# Altium schematic sheet usb.SchDoc: {Наименование}
size 209 x 297 mm; DocumentNumber: {Обозначение}; SheetNumber: {}; SheetTotal: {}; PageSetup: Record=PageOptions|CenterHorizontal=False|CenterVertical=False|PrintScale=0.95|XCorrection=0.00|YCorrection=0.00|PrintKind=1|BorderSize=5000000|LeftOffset=0|BottomOffset=0|Orientation=1|PaperLength=1000|PaperWidth=1000|Scale=100|PaperSource=15|PrintQuality=600|MediaType=1|DitherType=10|PaperKind=A4|PrintScaleMode=1; Rule: PcbType=ProtelPcb
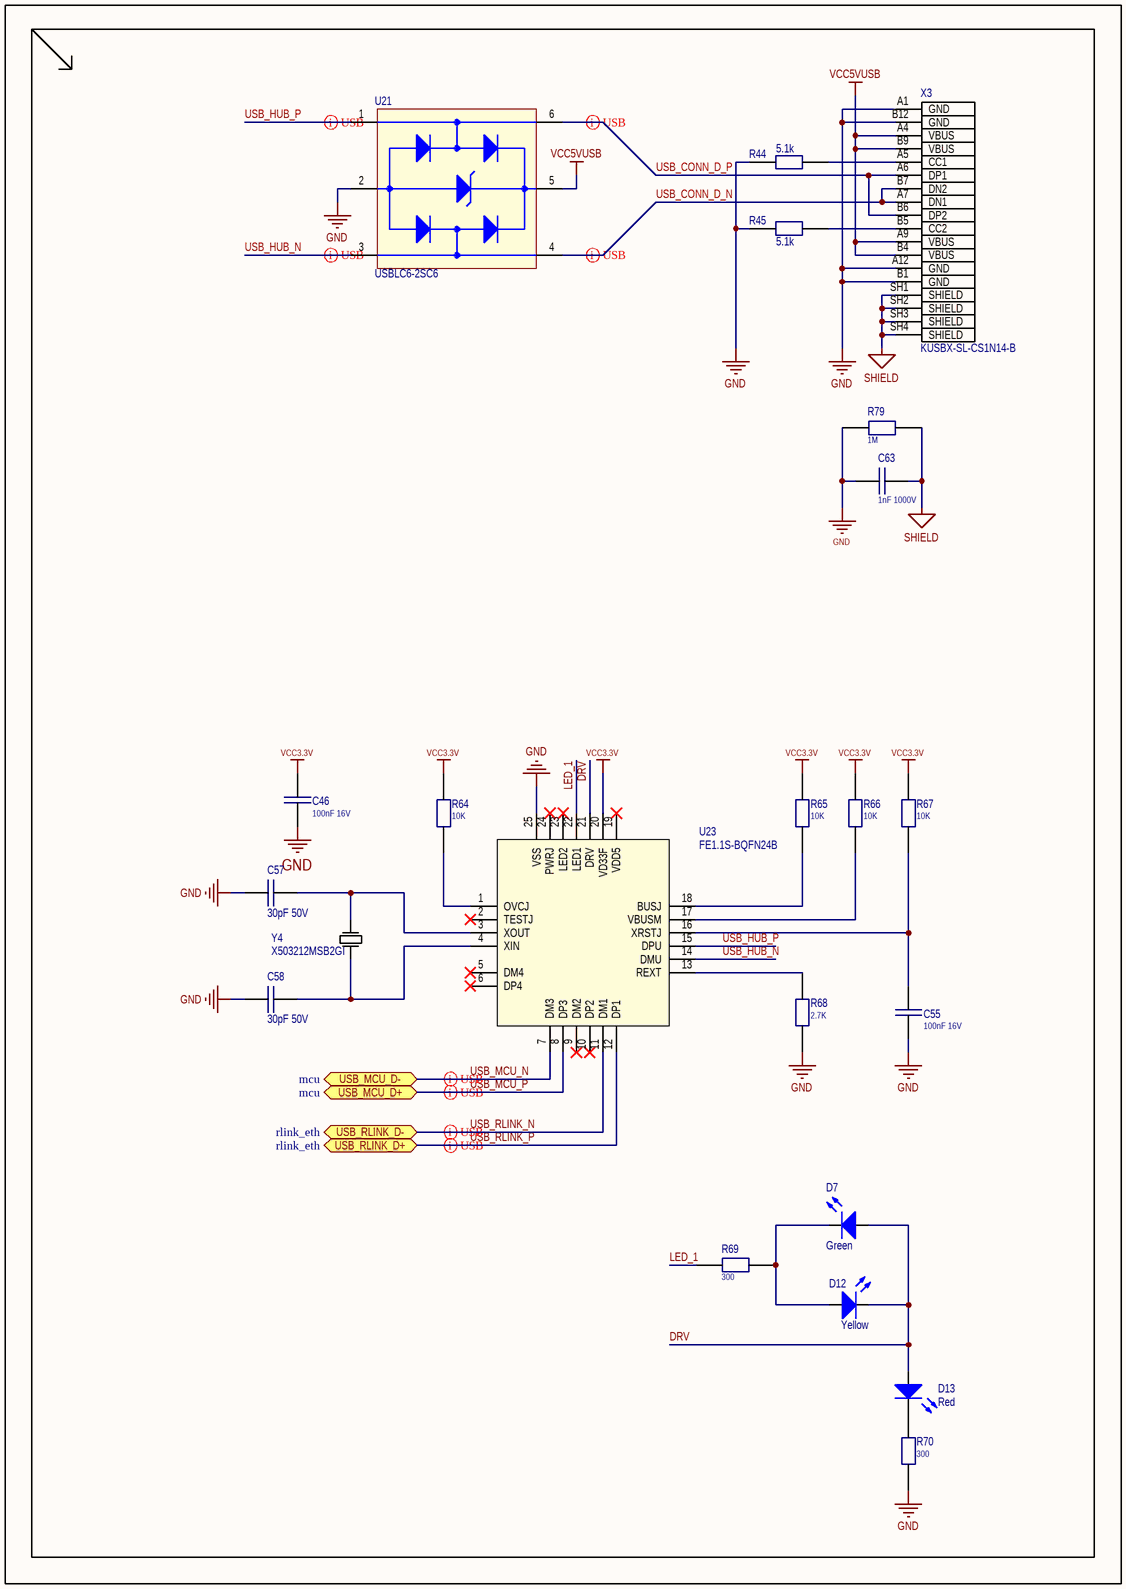
[diagram p0: usb.SchDoc]

## Parts
C46  100nF 16V  [C_0402]
C55  100nF 16V  [C_0402]
C57  30pF 50V  [C_0603]
C58  30pF 50V  [C_0603]
C63  1nF 1000V  [C_1206]
D7  Green  [LED_0603]
D12  Yellow  [LED_0603]
D13  Red  [LED_0603]
R44  5.1k  [R_0603]
R45  5.1k  [R_0603]
R64  10K  [R_0402]
R65  10K  [R_0402]
R66  10K  [R_0402]
R67  10K  [R_0402]
R68  2.7K  [R_0402]
R69  300  [R_0603]
R70  300  [R_0603]
R79  1M  [R_1206]
U21  USBLC6-2SC6  [SOT95P280X145-6N]
U23  FE1.1S-BQFN24B  [QFN50P400X400X80-25N-D]
X3  KUSBX-SL-CS1N14-B  [MOLEX_2169890001]
Y4  X503212MSB2GI  [X5032]

## Ports
USB_MCU_D+ (bidir, see mcu), USB_MCU_D- (bidir, see mcu), USB_RLINK_D+ (bidir, see rlink_eth), USB_RLINK_D- (bidir, see rlink_eth)

## Nets
GND: C46.1 C55.2 C57.2 C58.2 C63.1 R44.1 R45.1 R68.2 R70.1 R79.1 U21.2(GND) U23.25(VSS) X3.A1(GND) X3.A12(GND) X3.B1(GND) X3.B12(GND)
SHIELD: C63.2 R79.2 X3.SH1(SHIELD) X3.SH2(SHIELD) X3.SH3(SHIELD) X3.SH4(SHIELD)
VCC3.3V: C46.2 R64.2 R65.2 R66.2 R67.2 U23.20(VD33F)
VCC5VUSB: U21.5(VBUS) X3.A4(VBUS) X3.A9(VBUS) X3.B4(VBUS) X3.B9(VBUS)
DRV: D7.1(A) D12.2(K) D13.1(A) U23.21(DRV)
LED_1: R69.2 U23.22(LED1)
USB_CONN_D_N: U21.4(I/O2_OUT) X3.A7(DN1) X3.B7(DN2)
USB_CONN_D_P: U21.6(I/O1_OUT) X3.A6(DP1) X3.B6(DP2)
USB_HUB_N: U21.3(I/O2_IN) U23.14(DMU)
USB_HUB_P: U21.1(I/O1_IN) U23.15(DPU)
USB_MCU_N: U23.7(DM3) ; port USB_MCU_D-
USB_MCU_P: U23.8(DP3) ; port USB_MCU_D+
USB_RLINK_N: U23.11(DM1) ; port USB_RLINK_D-
USB_RLINK_P: U23.12(DP1) ; port USB_RLINK_D+
NetC55_1: C55.1 R67.1 U23.16(XRSTJ)
NetC57_1: C57.1 U23.3(XOUT) Y4.1
NetC58_1: C58.1 U23.4(XIN) Y4.2
NetD7_2: D7.2(K) D12.1(A) R69.1
NetD13_2: D13.2(K) R70.2
NetR44_2: R44.2 X3.A5(CC1)
NetR45_2: R45.2 X3.B5(CC2)
NetR64_1: R64.1 U23.1(OVCJ)
NetR65_1: R65.1 U23.18(BUSJ)
NetR66_1: R66.1 U23.17(VBUSM)
NetR68_1: R68.1 U23.13(REXT)

Not connected (* = marked no-connect by the designer): U23 2(TESTJ)* 5(DM4)* 6(DP4)* 9(DM2)* 10(DP2)* 19(VDD5)* 23(LED2)* 24(PWRJ)*

## Layout directives
differential pair; net class USB_HUB; differential pair class USB: USB_HUB_N, USB_HUB_P
differential pair; net class USB_C; differential pair class USB: USB_CONN_D_N, USB_CONN_D_P
differential pair; net class USB_MCU; differential pair class USB: USB_MCU_N, USB_MCU_P
differential pair; net class USB_RLINK; differential pair class USB: USB_RLINK_N, USB_RLINK_P

## Library data of the parts
C46 C55 = C0402: Capacitor; Part: CC0402KRX7R7BB104; Alternative Part: CC0402KRX5R7BB104
C57 C58 = CAP_SMD: Capacitor; Part: CC0603JRNPO9BN300; Alternative Part: *; Value: 30pF 50V
C63 = C1206: Capacitor; Part: CC1206KKX7RCBB102; Alternative Part: CL31B102KIFNNNE; Value: 1nF 1000V
D7 D12 D13 = LED_SMT_0603: LED; Part: FYLS-0603PGC; Alternative Part: KP-1608CGCK; Value: *
  D7: Color: Green
  D12: Color: Yellow
  D13: Color: Red
R44 R45 = RES_SMD: Resistor; Part: RC0603JR-075K1L; Alternative Part: *; Value: 5.1k
R64-R67 = R0402: Resistor; Part: RC0402JR-0710KL; Value: 10K; Alternative Part: *
R68 = R0402: Resistor; Part: RC0402FR-072K7L; Value: 2.7K; Alternative Part: *
R69 R70 = R0603: Resistor; Part: RC0603FR-07300RL; Value: 300
R79 = R1206: Resistor; Part: RC1206FR-071ML; Value: 1M; Alternative Part: *
U21 = USBLC6-2SC6: 17V Clamp 5A (8/20Âµs) Ipp Tvs Diode Surface Mount SOT-23-6; MF: STMicroelectronics; Value: *; Check_prices: https://www.snapeda.com/parts/USBLC6-2SC6/STMicroelectronics/view-part/?ref=eda; MP: USBLC6-2SC6; Purchase-URL: https://pricing.snapeda.com/search/part/USBLC6-2SC6/?ref=eda; Price: None; Availability: In Stock; Package: SOT-23-6 STMicroelectronics; SnapEDA_Link: https://www.snapeda.com/parts/USBLC6-2SC6/STMicroelectronics/view-part/?ref=snap; Part: USBLC6-2SC6; Alternative Part: *
U23 = FE1.1S-BQFN24B: USB 2.0 HIGH SPEED 4-PORT HUB CONTROLLER; Manufacturer_Name: Terminus Technology; Datasheet Link: https://datasheet.lcsc.com/lcsc/2306141021_Terminus-Tech-FE1-1S-BQFN24B_C6776948.pdf; Height: 0.8mm; Part: FE1.1S-BQFN24B; Alternative Part: *
X3 = MOLEX_216989-0001: USB Connector USB TYPE C UPRIGHT STRAIGHT TAB 14 PIN; Part: KUSBX-SL-CS1N14-B
Y4 = X503212MSB2GI: Crystal Oscillator; Manufacturer_Name: Yangxing Tech; Geometry.Height: 1.35mm; Manufacturer_Part_Number: X503212MSB2GI; Part: X503212MSB2GI; Mouser Price/Stock: *; Alternative Part: *; Arrow Price/Stock: *; Datasheet Link: https://datasheet.lcsc.com/szlcsc/Yangxing-Tech-X503212MSB2GI_C112573.pdf